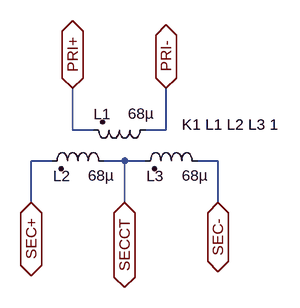
[diagram p0: schematic CX2047LANL.asc]
CX2047LANL.asc, the LTspice schematic file:
Version 4
SHEET 1 880 680
WIRE 16 112 16 48
WIRE 48 112 16 112
WIRE 160 112 160 48
WIRE 160 112 128 112
WIRE -16 160 -48 160
WIRE 96 160 64 160
WIRE 128 160 96 160
WIRE 240 160 208 160
WIRE -48 224 -48 160
WIRE 96 224 96 160
WIRE 240 224 240 160
FLAG 16 48 PRI+
IOPIN 16 48 BiDir
FLAG 160 48 PRI-
IOPIN 160 48 BiDir
FLAG 96 224 SECCT
IOPIN 96 224 BiDir
FLAG 240 224 SEC-
IOPIN 240 224 BiDir
FLAG -48 224 SEC+
IOPIN -48 224 BiDir
SYMBOL ind2 144 96 R90
WINDOW 0 -8 69 VRight 2
WINDOW 3 -9 43 VLeft 2
SYMATTR InstName L1
SYMATTR Value 68µ
SYMATTR Type ind
SYMBOL ind2 80 176 M270
WINDOW 0 -7 67 VRight 2
WINDOW 3 -6 40 VLeft 2
SYMATTR InstName L2
SYMATTR Value 68µ
SYMATTR Type ind
SYMBOL ind2 224 176 M270
WINDOW 0 -7 67 VRight 2
WINDOW 3 -6 40 VLeft 2
SYMATTR InstName L3
SYMATTR Value 68µ
SYMATTR Type ind
TEXT 184 104 Left 2 !K1 L1 L2 L3 1

The netlist it stands for:
* CX2047LANL.asc
L1 PRI- PRI+ 68µ
L2 SECCT SEC+ 68µ
L3 SEC- SECCT 68µ
K1 L1 L2 L3 1
.backanno
.end